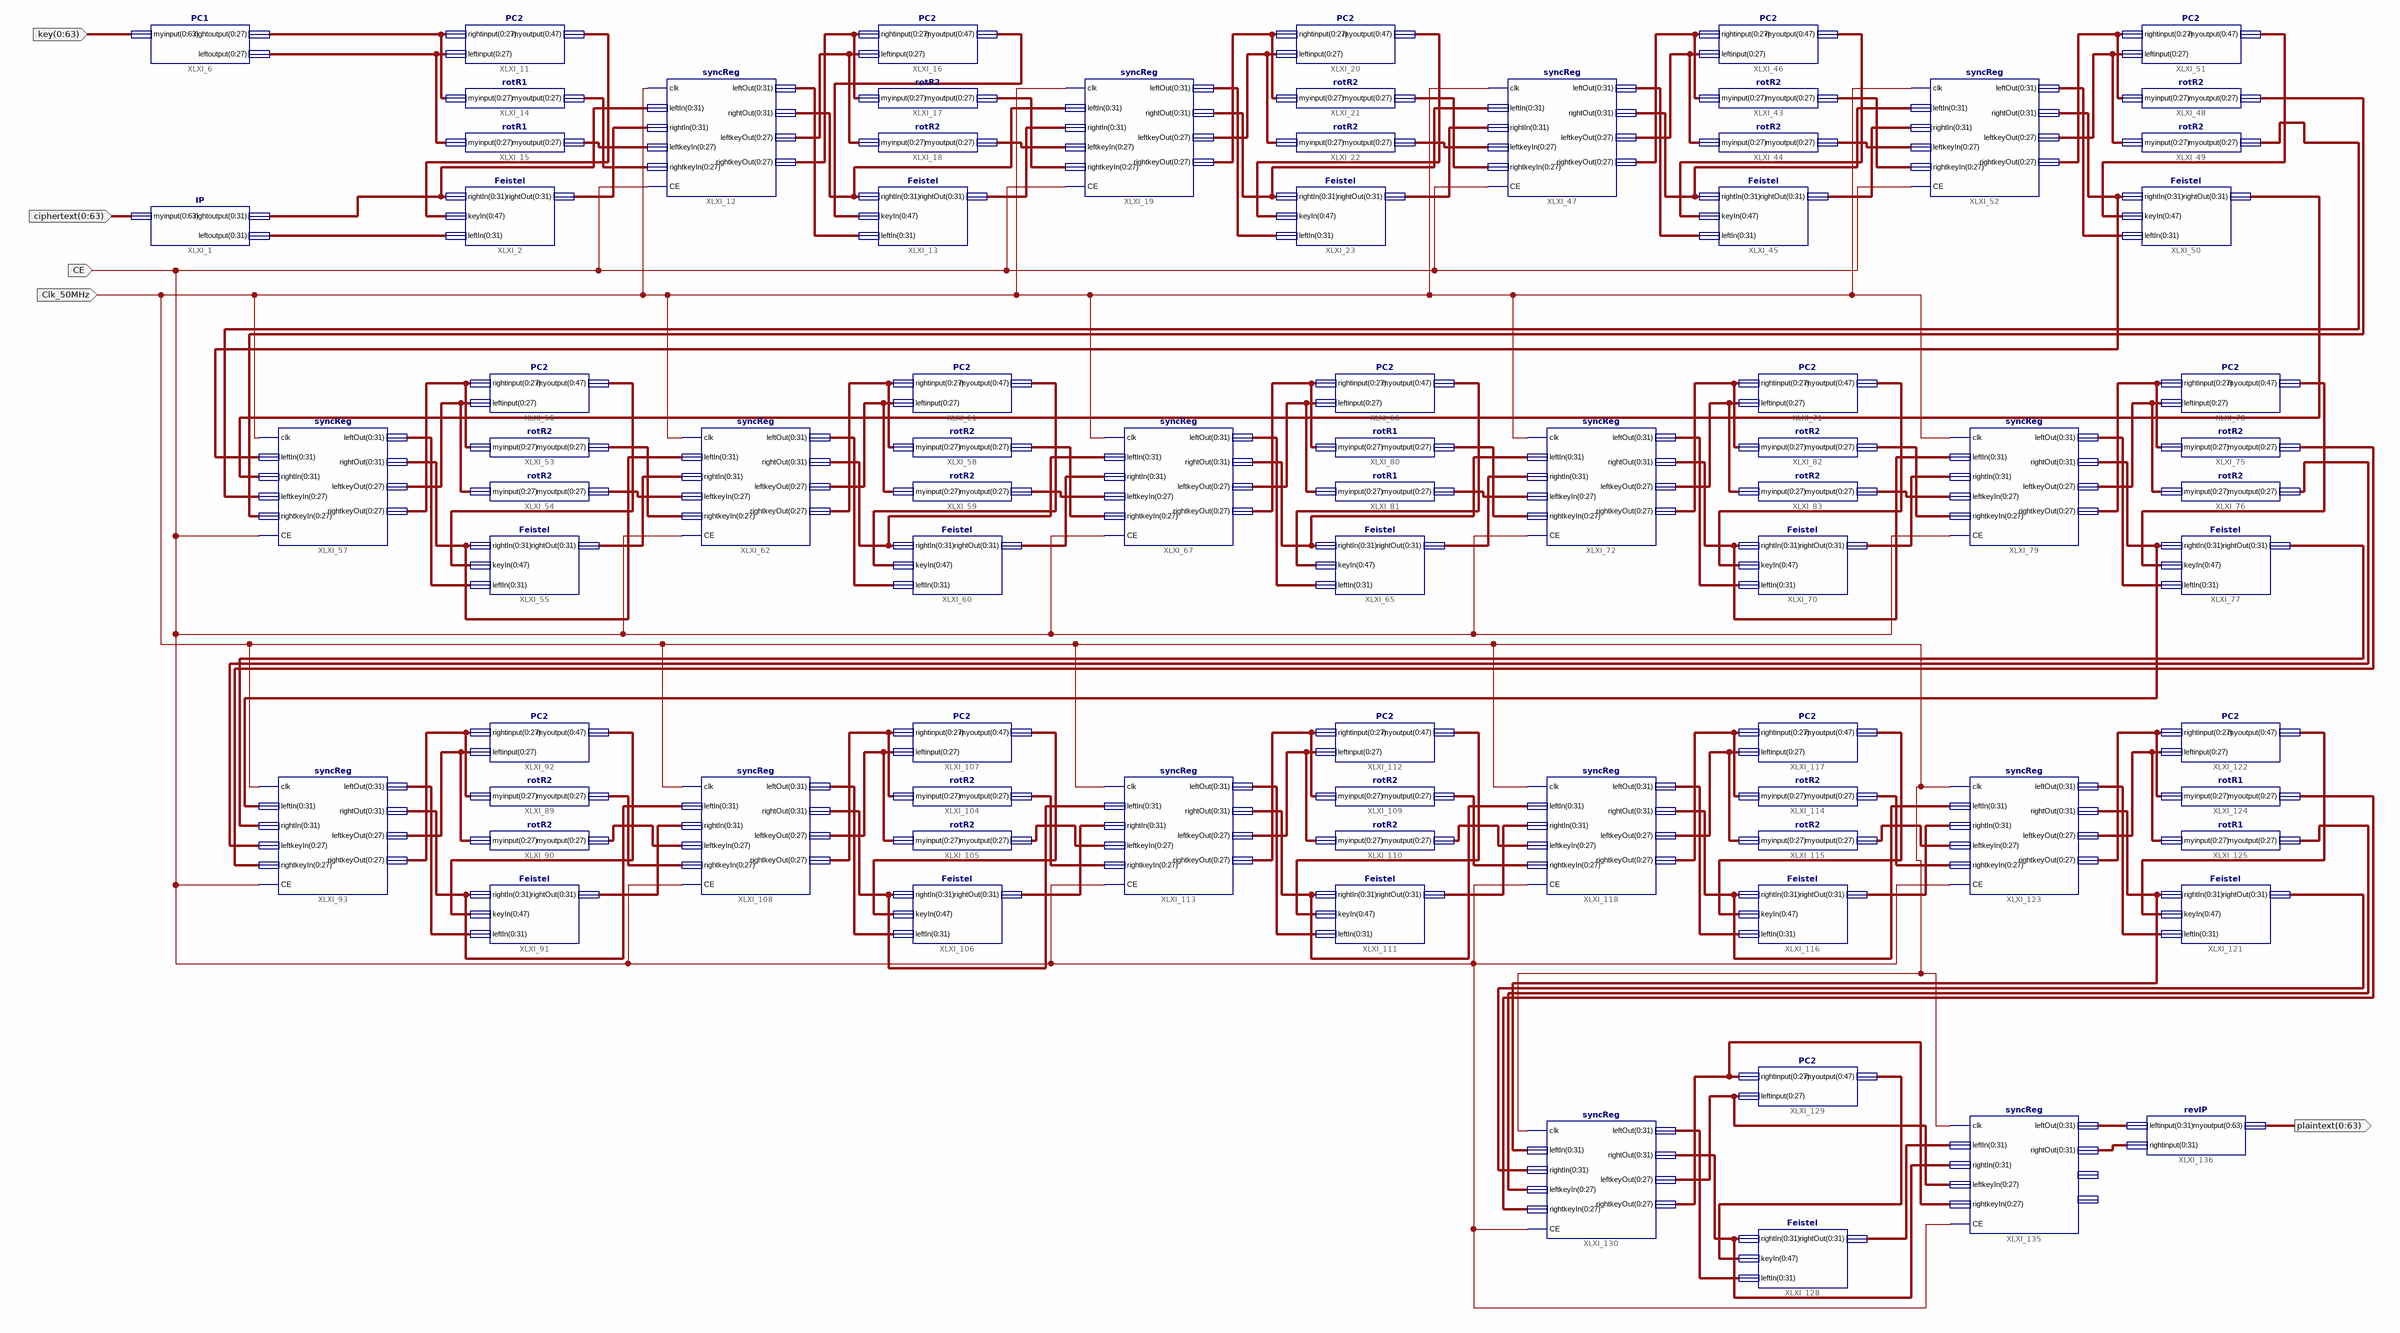
[diagram p0: schematic sheet 1]
// Xilinx ISE schematic DES_Decoder.sch (spartan3e) as structural Verilog: 81 symbols, 5 ports
module DES_Decoder (
  input  [0:63] ciphertext,
  input  [0:63] key,
  input  CE,
  input  Clk_50MHz,
  output [0:63] plaintext
);

  wire [27:0] XLXN_112, XLXN_113, XLXN_116, XLXN_117, XLXN_120, XLXN_121, XLXN_130, XLXN_131, XLXN_134,
       XLXN_135, XLXN_171, XLXN_172, XLXN_176, XLXN_177, XLXN_180, XLXN_181, XLXN_185, XLXN_186, XLXN_189,
       XLXN_190, XLXN_198, XLXN_199, XLXN_203, XLXN_204, XLXN_207, XLXN_208, XLXN_212, XLXN_213, XLXN_216,
       XLXN_217, XLXN_221, XLXN_222, XLXN_225, XLXN_226, XLXN_230, XLXN_231, XLXN_246, XLXN_247, XLXN_271,
       XLXN_272, XLXN_280, XLXN_284, XLXN_288, XLXN_289, XLXN_292, XLXN_293, XLXN_297, XLXN_298, XLXN_301,
       XLXN_302, XLXN_306, XLXN_307, XLXN_310, XLXN_311, XLXN_322, XLXN_323, XLXN_326, XLXN_330, XLXN_334,
       XLXN_337, XLXN_350, XLXN_352;
  wire [31:0] XLXN_20, XLXN_108, XLXN_118, XLXN_122, XLXN_123, XLXN_129, XLXN_132, XLXN_133, XLXN_169,
       XLXN_170, XLXN_175, XLXN_178, XLXN_179, XLXN_184, XLXN_187, XLXN_188, XLXN_196, XLXN_197, XLXN_202,
       XLXN_205, XLXN_206, XLXN_211, XLXN_214, XLXN_215, XLXN_220, XLXN_223, XLXN_224, XLXN_229, XLXN_244,
       XLXN_245, XLXN_269, XLXN_270, XLXN_285, XLXN_286, XLXN_287, XLXN_294, XLXN_295, XLXN_296, XLXN_303,
       XLXN_305, XLXN_312, XLXN_314, XLXN_332, XLXN_342, XLXN_359, XLXN_363, XLXN_387, XLXN_389, XLXN_390,
       XLXN_391;
  wire [47:0] XLXN_107, XLXN_125, XLXN_138, XLXN_173, XLXN_182, XLXN_191, XLXN_200, XLXN_209, XLXN_218,
       XLXN_227, XLXN_248, XLXN_273, XLXN_290, XLXN_299, XLXN_308, XLXN_317;

  IP XLXI_1 (
    .myinput(ciphertext),
    .rightoutput({XLXN_118[0], XLXN_118[1], XLXN_118[2], XLXN_118[3], XLXN_118[4], XLXN_118[5], XLXN_118[6], XLXN_118[7], XLXN_118[8], XLXN_118[9], XLXN_118[10], XLXN_118[11], XLXN_118[12], XLXN_118[13], XLXN_118[14], XLXN_118[15], XLXN_118[16], XLXN_118[17], XLXN_118[18], XLXN_118[19], XLXN_118[20], XLXN_118[21], XLXN_118[22], XLXN_118[23], XLXN_118[24], XLXN_118[25], XLXN_118[26], XLXN_118[27], XLXN_118[28], XLXN_118[29], XLXN_118[30], XLXN_118[31]}),
    .leftoutput({XLXN_20[0], XLXN_20[1], XLXN_20[2], XLXN_20[3], XLXN_20[4], XLXN_20[5], XLXN_20[6], XLXN_20[7], XLXN_20[8], XLXN_20[9], XLXN_20[10], XLXN_20[11], XLXN_20[12], XLXN_20[13], XLXN_20[14], XLXN_20[15], XLXN_20[16], XLXN_20[17], XLXN_20[18], XLXN_20[19], XLXN_20[20], XLXN_20[21], XLXN_20[22], XLXN_20[23], XLXN_20[24], XLXN_20[25], XLXN_20[26], XLXN_20[27], XLXN_20[28], XLXN_20[29], XLXN_20[30], XLXN_20[31]}));
  Feistel XLXI_2 (
    .rightIn({XLXN_118[0], XLXN_118[1], XLXN_118[2], XLXN_118[3], XLXN_118[4], XLXN_118[5], XLXN_118[6], XLXN_118[7], XLXN_118[8], XLXN_118[9], XLXN_118[10], XLXN_118[11], XLXN_118[12], XLXN_118[13], XLXN_118[14], XLXN_118[15], XLXN_118[16], XLXN_118[17], XLXN_118[18], XLXN_118[19], XLXN_118[20], XLXN_118[21], XLXN_118[22], XLXN_118[23], XLXN_118[24], XLXN_118[25], XLXN_118[26], XLXN_118[27], XLXN_118[28], XLXN_118[29], XLXN_118[30], XLXN_118[31]}),
    .keyIn({XLXN_107[0], XLXN_107[1], XLXN_107[2], XLXN_107[3], XLXN_107[4], XLXN_107[5], XLXN_107[6], XLXN_107[7], XLXN_107[8], XLXN_107[9], XLXN_107[10], XLXN_107[11], XLXN_107[12], XLXN_107[13], XLXN_107[14], XLXN_107[15], XLXN_107[16], XLXN_107[17], XLXN_107[18], XLXN_107[19], XLXN_107[20], XLXN_107[21], XLXN_107[22], XLXN_107[23], XLXN_107[24], XLXN_107[25], XLXN_107[26], XLXN_107[27], XLXN_107[28], XLXN_107[29], XLXN_107[30], XLXN_107[31], XLXN_107[32], XLXN_107[33], XLXN_107[34], XLXN_107[35], XLXN_107[36], XLXN_107[37], XLXN_107[38], XLXN_107[39], XLXN_107[40], XLXN_107[41], XLXN_107[42], XLXN_107[43], XLXN_107[44], XLXN_107[45], XLXN_107[46], XLXN_107[47]}),
    .leftIn({XLXN_20[0], XLXN_20[1], XLXN_20[2], XLXN_20[3], XLXN_20[4], XLXN_20[5], XLXN_20[6], XLXN_20[7], XLXN_20[8], XLXN_20[9], XLXN_20[10], XLXN_20[11], XLXN_20[12], XLXN_20[13], XLXN_20[14], XLXN_20[15], XLXN_20[16], XLXN_20[17], XLXN_20[18], XLXN_20[19], XLXN_20[20], XLXN_20[21], XLXN_20[22], XLXN_20[23], XLXN_20[24], XLXN_20[25], XLXN_20[26], XLXN_20[27], XLXN_20[28], XLXN_20[29], XLXN_20[30], XLXN_20[31]}),
    .rightOut({XLXN_108[0], XLXN_108[1], XLXN_108[2], XLXN_108[3], XLXN_108[4], XLXN_108[5], XLXN_108[6], XLXN_108[7], XLXN_108[8], XLXN_108[9], XLXN_108[10], XLXN_108[11], XLXN_108[12], XLXN_108[13], XLXN_108[14], XLXN_108[15], XLXN_108[16], XLXN_108[17], XLXN_108[18], XLXN_108[19], XLXN_108[20], XLXN_108[21], XLXN_108[22], XLXN_108[23], XLXN_108[24], XLXN_108[25], XLXN_108[26], XLXN_108[27], XLXN_108[28], XLXN_108[29], XLXN_108[30], XLXN_108[31]}));
  PC1 XLXI_6 (
    .myinput(key),
    .rightoutput({XLXN_112[0], XLXN_112[1], XLXN_112[2], XLXN_112[3], XLXN_112[4], XLXN_112[5], XLXN_112[6], XLXN_112[7], XLXN_112[8], XLXN_112[9], XLXN_112[10], XLXN_112[11], XLXN_112[12], XLXN_112[13], XLXN_112[14], XLXN_112[15], XLXN_112[16], XLXN_112[17], XLXN_112[18], XLXN_112[19], XLXN_112[20], XLXN_112[21], XLXN_112[22], XLXN_112[23], XLXN_112[24], XLXN_112[25], XLXN_112[26], XLXN_112[27]}),
    .leftoutput({XLXN_113[0], XLXN_113[1], XLXN_113[2], XLXN_113[3], XLXN_113[4], XLXN_113[5], XLXN_113[6], XLXN_113[7], XLXN_113[8], XLXN_113[9], XLXN_113[10], XLXN_113[11], XLXN_113[12], XLXN_113[13], XLXN_113[14], XLXN_113[15], XLXN_113[16], XLXN_113[17], XLXN_113[18], XLXN_113[19], XLXN_113[20], XLXN_113[21], XLXN_113[22], XLXN_113[23], XLXN_113[24], XLXN_113[25], XLXN_113[26], XLXN_113[27]}));
  PC2 XLXI_11 (
    .rightinput({XLXN_112[0], XLXN_112[1], XLXN_112[2], XLXN_112[3], XLXN_112[4], XLXN_112[5], XLXN_112[6], XLXN_112[7], XLXN_112[8], XLXN_112[9], XLXN_112[10], XLXN_112[11], XLXN_112[12], XLXN_112[13], XLXN_112[14], XLXN_112[15], XLXN_112[16], XLXN_112[17], XLXN_112[18], XLXN_112[19], XLXN_112[20], XLXN_112[21], XLXN_112[22], XLXN_112[23], XLXN_112[24], XLXN_112[25], XLXN_112[26], XLXN_112[27]}),
    .leftinput({XLXN_113[0], XLXN_113[1], XLXN_113[2], XLXN_113[3], XLXN_113[4], XLXN_113[5], XLXN_113[6], XLXN_113[7], XLXN_113[8], XLXN_113[9], XLXN_113[10], XLXN_113[11], XLXN_113[12], XLXN_113[13], XLXN_113[14], XLXN_113[15], XLXN_113[16], XLXN_113[17], XLXN_113[18], XLXN_113[19], XLXN_113[20], XLXN_113[21], XLXN_113[22], XLXN_113[23], XLXN_113[24], XLXN_113[25], XLXN_113[26], XLXN_113[27]}),
    .myoutput({XLXN_107[0], XLXN_107[1], XLXN_107[2], XLXN_107[3], XLXN_107[4], XLXN_107[5], XLXN_107[6], XLXN_107[7], XLXN_107[8], XLXN_107[9], XLXN_107[10], XLXN_107[11], XLXN_107[12], XLXN_107[13], XLXN_107[14], XLXN_107[15], XLXN_107[16], XLXN_107[17], XLXN_107[18], XLXN_107[19], XLXN_107[20], XLXN_107[21], XLXN_107[22], XLXN_107[23], XLXN_107[24], XLXN_107[25], XLXN_107[26], XLXN_107[27], XLXN_107[28], XLXN_107[29], XLXN_107[30], XLXN_107[31], XLXN_107[32], XLXN_107[33], XLXN_107[34], XLXN_107[35], XLXN_107[36], XLXN_107[37], XLXN_107[38], XLXN_107[39], XLXN_107[40], XLXN_107[41], XLXN_107[42], XLXN_107[43], XLXN_107[44], XLXN_107[45], XLXN_107[46], XLXN_107[47]}));
  syncReg XLXI_12 (
    .clk(Clk_50MHz),
    .leftIn({XLXN_118[0], XLXN_118[1], XLXN_118[2], XLXN_118[3], XLXN_118[4], XLXN_118[5], XLXN_118[6], XLXN_118[7], XLXN_118[8], XLXN_118[9], XLXN_118[10], XLXN_118[11], XLXN_118[12], XLXN_118[13], XLXN_118[14], XLXN_118[15], XLXN_118[16], XLXN_118[17], XLXN_118[18], XLXN_118[19], XLXN_118[20], XLXN_118[21], XLXN_118[22], XLXN_118[23], XLXN_118[24], XLXN_118[25], XLXN_118[26], XLXN_118[27], XLXN_118[28], XLXN_118[29], XLXN_118[30], XLXN_118[31]}),
    .rightIn({XLXN_108[0], XLXN_108[1], XLXN_108[2], XLXN_108[3], XLXN_108[4], XLXN_108[5], XLXN_108[6], XLXN_108[7], XLXN_108[8], XLXN_108[9], XLXN_108[10], XLXN_108[11], XLXN_108[12], XLXN_108[13], XLXN_108[14], XLXN_108[15], XLXN_108[16], XLXN_108[17], XLXN_108[18], XLXN_108[19], XLXN_108[20], XLXN_108[21], XLXN_108[22], XLXN_108[23], XLXN_108[24], XLXN_108[25], XLXN_108[26], XLXN_108[27], XLXN_108[28], XLXN_108[29], XLXN_108[30], XLXN_108[31]}),
    .leftkeyIn({XLXN_117[0], XLXN_117[1], XLXN_117[2], XLXN_117[3], XLXN_117[4], XLXN_117[5], XLXN_117[6], XLXN_117[7], XLXN_117[8], XLXN_117[9], XLXN_117[10], XLXN_117[11], XLXN_117[12], XLXN_117[13], XLXN_117[14], XLXN_117[15], XLXN_117[16], XLXN_117[17], XLXN_117[18], XLXN_117[19], XLXN_117[20], XLXN_117[21], XLXN_117[22], XLXN_117[23], XLXN_117[24], XLXN_117[25], XLXN_117[26], XLXN_117[27]}),
    .rightkeyIn({XLXN_116[0], XLXN_116[1], XLXN_116[2], XLXN_116[3], XLXN_116[4], XLXN_116[5], XLXN_116[6], XLXN_116[7], XLXN_116[8], XLXN_116[9], XLXN_116[10], XLXN_116[11], XLXN_116[12], XLXN_116[13], XLXN_116[14], XLXN_116[15], XLXN_116[16], XLXN_116[17], XLXN_116[18], XLXN_116[19], XLXN_116[20], XLXN_116[21], XLXN_116[22], XLXN_116[23], XLXN_116[24], XLXN_116[25], XLXN_116[26], XLXN_116[27]}),
    .leftOut({XLXN_123[0], XLXN_123[1], XLXN_123[2], XLXN_123[3], XLXN_123[4], XLXN_123[5], XLXN_123[6], XLXN_123[7], XLXN_123[8], XLXN_123[9], XLXN_123[10], XLXN_123[11], XLXN_123[12], XLXN_123[13], XLXN_123[14], XLXN_123[15], XLXN_123[16], XLXN_123[17], XLXN_123[18], XLXN_123[19], XLXN_123[20], XLXN_123[21], XLXN_123[22], XLXN_123[23], XLXN_123[24], XLXN_123[25], XLXN_123[26], XLXN_123[27], XLXN_123[28], XLXN_123[29], XLXN_123[30], XLXN_123[31]}),
    .rightOut({XLXN_122[0], XLXN_122[1], XLXN_122[2], XLXN_122[3], XLXN_122[4], XLXN_122[5], XLXN_122[6], XLXN_122[7], XLXN_122[8], XLXN_122[9], XLXN_122[10], XLXN_122[11], XLXN_122[12], XLXN_122[13], XLXN_122[14], XLXN_122[15], XLXN_122[16], XLXN_122[17], XLXN_122[18], XLXN_122[19], XLXN_122[20], XLXN_122[21], XLXN_122[22], XLXN_122[23], XLXN_122[24], XLXN_122[25], XLXN_122[26], XLXN_122[27], XLXN_122[28], XLXN_122[29], XLXN_122[30], XLXN_122[31]}),
    .leftkeyOut({XLXN_121[0], XLXN_121[1], XLXN_121[2], XLXN_121[3], XLXN_121[4], XLXN_121[5], XLXN_121[6], XLXN_121[7], XLXN_121[8], XLXN_121[9], XLXN_121[10], XLXN_121[11], XLXN_121[12], XLXN_121[13], XLXN_121[14], XLXN_121[15], XLXN_121[16], XLXN_121[17], XLXN_121[18], XLXN_121[19], XLXN_121[20], XLXN_121[21], XLXN_121[22], XLXN_121[23], XLXN_121[24], XLXN_121[25], XLXN_121[26], XLXN_121[27]}),
    .rightkeyOut({XLXN_120[0], XLXN_120[1], XLXN_120[2], XLXN_120[3], XLXN_120[4], XLXN_120[5], XLXN_120[6], XLXN_120[7], XLXN_120[8], XLXN_120[9], XLXN_120[10], XLXN_120[11], XLXN_120[12], XLXN_120[13], XLXN_120[14], XLXN_120[15], XLXN_120[16], XLXN_120[17], XLXN_120[18], XLXN_120[19], XLXN_120[20], XLXN_120[21], XLXN_120[22], XLXN_120[23], XLXN_120[24], XLXN_120[25], XLXN_120[26], XLXN_120[27]}),
    .CE(CE));
  Feistel XLXI_13 (
    .rightIn({XLXN_122[0], XLXN_122[1], XLXN_122[2], XLXN_122[3], XLXN_122[4], XLXN_122[5], XLXN_122[6], XLXN_122[7], XLXN_122[8], XLXN_122[9], XLXN_122[10], XLXN_122[11], XLXN_122[12], XLXN_122[13], XLXN_122[14], XLXN_122[15], XLXN_122[16], XLXN_122[17], XLXN_122[18], XLXN_122[19], XLXN_122[20], XLXN_122[21], XLXN_122[22], XLXN_122[23], XLXN_122[24], XLXN_122[25], XLXN_122[26], XLXN_122[27], XLXN_122[28], XLXN_122[29], XLXN_122[30], XLXN_122[31]}),
    .keyIn({XLXN_125[0], XLXN_125[1], XLXN_125[2], XLXN_125[3], XLXN_125[4], XLXN_125[5], XLXN_125[6], XLXN_125[7], XLXN_125[8], XLXN_125[9], XLXN_125[10], XLXN_125[11], XLXN_125[12], XLXN_125[13], XLXN_125[14], XLXN_125[15], XLXN_125[16], XLXN_125[17], XLXN_125[18], XLXN_125[19], XLXN_125[20], XLXN_125[21], XLXN_125[22], XLXN_125[23], XLXN_125[24], XLXN_125[25], XLXN_125[26], XLXN_125[27], XLXN_125[28], XLXN_125[29], XLXN_125[30], XLXN_125[31], XLXN_125[32], XLXN_125[33], XLXN_125[34], XLXN_125[35], XLXN_125[36], XLXN_125[37], XLXN_125[38], XLXN_125[39], XLXN_125[40], XLXN_125[41], XLXN_125[42], XLXN_125[43], XLXN_125[44], XLXN_125[45], XLXN_125[46], XLXN_125[47]}),
    .leftIn({XLXN_123[0], XLXN_123[1], XLXN_123[2], XLXN_123[3], XLXN_123[4], XLXN_123[5], XLXN_123[6], XLXN_123[7], XLXN_123[8], XLXN_123[9], XLXN_123[10], XLXN_123[11], XLXN_123[12], XLXN_123[13], XLXN_123[14], XLXN_123[15], XLXN_123[16], XLXN_123[17], XLXN_123[18], XLXN_123[19], XLXN_123[20], XLXN_123[21], XLXN_123[22], XLXN_123[23], XLXN_123[24], XLXN_123[25], XLXN_123[26], XLXN_123[27], XLXN_123[28], XLXN_123[29], XLXN_123[30], XLXN_123[31]}),
    .rightOut({XLXN_129[0], XLXN_129[1], XLXN_129[2], XLXN_129[3], XLXN_129[4], XLXN_129[5], XLXN_129[6], XLXN_129[7], XLXN_129[8], XLXN_129[9], XLXN_129[10], XLXN_129[11], XLXN_129[12], XLXN_129[13], XLXN_129[14], XLXN_129[15], XLXN_129[16], XLXN_129[17], XLXN_129[18], XLXN_129[19], XLXN_129[20], XLXN_129[21], XLXN_129[22], XLXN_129[23], XLXN_129[24], XLXN_129[25], XLXN_129[26], XLXN_129[27], XLXN_129[28], XLXN_129[29], XLXN_129[30], XLXN_129[31]}));
  rotR1 XLXI_14 (
    .myinput({XLXN_112[0], XLXN_112[1], XLXN_112[2], XLXN_112[3], XLXN_112[4], XLXN_112[5], XLXN_112[6], XLXN_112[7], XLXN_112[8], XLXN_112[9], XLXN_112[10], XLXN_112[11], XLXN_112[12], XLXN_112[13], XLXN_112[14], XLXN_112[15], XLXN_112[16], XLXN_112[17], XLXN_112[18], XLXN_112[19], XLXN_112[20], XLXN_112[21], XLXN_112[22], XLXN_112[23], XLXN_112[24], XLXN_112[25], XLXN_112[26], XLXN_112[27]}),
    .myoutput({XLXN_116[0], XLXN_116[1], XLXN_116[2], XLXN_116[3], XLXN_116[4], XLXN_116[5], XLXN_116[6], XLXN_116[7], XLXN_116[8], XLXN_116[9], XLXN_116[10], XLXN_116[11], XLXN_116[12], XLXN_116[13], XLXN_116[14], XLXN_116[15], XLXN_116[16], XLXN_116[17], XLXN_116[18], XLXN_116[19], XLXN_116[20], XLXN_116[21], XLXN_116[22], XLXN_116[23], XLXN_116[24], XLXN_116[25], XLXN_116[26], XLXN_116[27]}));
  rotR1 XLXI_15 (
    .myinput({XLXN_113[0], XLXN_113[1], XLXN_113[2], XLXN_113[3], XLXN_113[4], XLXN_113[5], XLXN_113[6], XLXN_113[7], XLXN_113[8], XLXN_113[9], XLXN_113[10], XLXN_113[11], XLXN_113[12], XLXN_113[13], XLXN_113[14], XLXN_113[15], XLXN_113[16], XLXN_113[17], XLXN_113[18], XLXN_113[19], XLXN_113[20], XLXN_113[21], XLXN_113[22], XLXN_113[23], XLXN_113[24], XLXN_113[25], XLXN_113[26], XLXN_113[27]}),
    .myoutput({XLXN_117[0], XLXN_117[1], XLXN_117[2], XLXN_117[3], XLXN_117[4], XLXN_117[5], XLXN_117[6], XLXN_117[7], XLXN_117[8], XLXN_117[9], XLXN_117[10], XLXN_117[11], XLXN_117[12], XLXN_117[13], XLXN_117[14], XLXN_117[15], XLXN_117[16], XLXN_117[17], XLXN_117[18], XLXN_117[19], XLXN_117[20], XLXN_117[21], XLXN_117[22], XLXN_117[23], XLXN_117[24], XLXN_117[25], XLXN_117[26], XLXN_117[27]}));
  PC2 XLXI_16 (
    .rightinput({XLXN_120[0], XLXN_120[1], XLXN_120[2], XLXN_120[3], XLXN_120[4], XLXN_120[5], XLXN_120[6], XLXN_120[7], XLXN_120[8], XLXN_120[9], XLXN_120[10], XLXN_120[11], XLXN_120[12], XLXN_120[13], XLXN_120[14], XLXN_120[15], XLXN_120[16], XLXN_120[17], XLXN_120[18], XLXN_120[19], XLXN_120[20], XLXN_120[21], XLXN_120[22], XLXN_120[23], XLXN_120[24], XLXN_120[25], XLXN_120[26], XLXN_120[27]}),
    .leftinput({XLXN_121[0], XLXN_121[1], XLXN_121[2], XLXN_121[3], XLXN_121[4], XLXN_121[5], XLXN_121[6], XLXN_121[7], XLXN_121[8], XLXN_121[9], XLXN_121[10], XLXN_121[11], XLXN_121[12], XLXN_121[13], XLXN_121[14], XLXN_121[15], XLXN_121[16], XLXN_121[17], XLXN_121[18], XLXN_121[19], XLXN_121[20], XLXN_121[21], XLXN_121[22], XLXN_121[23], XLXN_121[24], XLXN_121[25], XLXN_121[26], XLXN_121[27]}),
    .myoutput({XLXN_125[0], XLXN_125[1], XLXN_125[2], XLXN_125[3], XLXN_125[4], XLXN_125[5], XLXN_125[6], XLXN_125[7], XLXN_125[8], XLXN_125[9], XLXN_125[10], XLXN_125[11], XLXN_125[12], XLXN_125[13], XLXN_125[14], XLXN_125[15], XLXN_125[16], XLXN_125[17], XLXN_125[18], XLXN_125[19], XLXN_125[20], XLXN_125[21], XLXN_125[22], XLXN_125[23], XLXN_125[24], XLXN_125[25], XLXN_125[26], XLXN_125[27], XLXN_125[28], XLXN_125[29], XLXN_125[30], XLXN_125[31], XLXN_125[32], XLXN_125[33], XLXN_125[34], XLXN_125[35], XLXN_125[36], XLXN_125[37], XLXN_125[38], XLXN_125[39], XLXN_125[40], XLXN_125[41], XLXN_125[42], XLXN_125[43], XLXN_125[44], XLXN_125[45], XLXN_125[46], XLXN_125[47]}));
  rotR2 XLXI_17 (
    .myinput({XLXN_120[0], XLXN_120[1], XLXN_120[2], XLXN_120[3], XLXN_120[4], XLXN_120[5], XLXN_120[6], XLXN_120[7], XLXN_120[8], XLXN_120[9], XLXN_120[10], XLXN_120[11], XLXN_120[12], XLXN_120[13], XLXN_120[14], XLXN_120[15], XLXN_120[16], XLXN_120[17], XLXN_120[18], XLXN_120[19], XLXN_120[20], XLXN_120[21], XLXN_120[22], XLXN_120[23], XLXN_120[24], XLXN_120[25], XLXN_120[26], XLXN_120[27]}),
    .myoutput({XLXN_130[0], XLXN_130[1], XLXN_130[2], XLXN_130[3], XLXN_130[4], XLXN_130[5], XLXN_130[6], XLXN_130[7], XLXN_130[8], XLXN_130[9], XLXN_130[10], XLXN_130[11], XLXN_130[12], XLXN_130[13], XLXN_130[14], XLXN_130[15], XLXN_130[16], XLXN_130[17], XLXN_130[18], XLXN_130[19], XLXN_130[20], XLXN_130[21], XLXN_130[22], XLXN_130[23], XLXN_130[24], XLXN_130[25], XLXN_130[26], XLXN_130[27]}));
  rotR2 XLXI_18 (
    .myinput({XLXN_121[0], XLXN_121[1], XLXN_121[2], XLXN_121[3], XLXN_121[4], XLXN_121[5], XLXN_121[6], XLXN_121[7], XLXN_121[8], XLXN_121[9], XLXN_121[10], XLXN_121[11], XLXN_121[12], XLXN_121[13], XLXN_121[14], XLXN_121[15], XLXN_121[16], XLXN_121[17], XLXN_121[18], XLXN_121[19], XLXN_121[20], XLXN_121[21], XLXN_121[22], XLXN_121[23], XLXN_121[24], XLXN_121[25], XLXN_121[26], XLXN_121[27]}),
    .myoutput({XLXN_131[0], XLXN_131[1], XLXN_131[2], XLXN_131[3], XLXN_131[4], XLXN_131[5], XLXN_131[6], XLXN_131[7], XLXN_131[8], XLXN_131[9], XLXN_131[10], XLXN_131[11], XLXN_131[12], XLXN_131[13], XLXN_131[14], XLXN_131[15], XLXN_131[16], XLXN_131[17], XLXN_131[18], XLXN_131[19], XLXN_131[20], XLXN_131[21], XLXN_131[22], XLXN_131[23], XLXN_131[24], XLXN_131[25], XLXN_131[26], XLXN_131[27]}));
  syncReg XLXI_19 (
    .clk(Clk_50MHz),
    .leftIn({XLXN_122[0], XLXN_122[1], XLXN_122[2], XLXN_122[3], XLXN_122[4], XLXN_122[5], XLXN_122[6], XLXN_122[7], XLXN_122[8], XLXN_122[9], XLXN_122[10], XLXN_122[11], XLXN_122[12], XLXN_122[13], XLXN_122[14], XLXN_122[15], XLXN_122[16], XLXN_122[17], XLXN_122[18], XLXN_122[19], XLXN_122[20], XLXN_122[21], XLXN_122[22], XLXN_122[23], XLXN_122[24], XLXN_122[25], XLXN_122[26], XLXN_122[27], XLXN_122[28], XLXN_122[29], XLXN_122[30], XLXN_122[31]}),
    .rightIn({XLXN_129[0], XLXN_129[1], XLXN_129[2], XLXN_129[3], XLXN_129[4], XLXN_129[5], XLXN_129[6], XLXN_129[7], XLXN_129[8], XLXN_129[9], XLXN_129[10], XLXN_129[11], XLXN_129[12], XLXN_129[13], XLXN_129[14], XLXN_129[15], XLXN_129[16], XLXN_129[17], XLXN_129[18], XLXN_129[19], XLXN_129[20], XLXN_129[21], XLXN_129[22], XLXN_129[23], XLXN_129[24], XLXN_129[25], XLXN_129[26], XLXN_129[27], XLXN_129[28], XLXN_129[29], XLXN_129[30], XLXN_129[31]}),
    .leftkeyIn({XLXN_131[0], XLXN_131[1], XLXN_131[2], XLXN_131[3], XLXN_131[4], XLXN_131[5], XLXN_131[6], XLXN_131[7], XLXN_131[8], XLXN_131[9], XLXN_131[10], XLXN_131[11], XLXN_131[12], XLXN_131[13], XLXN_131[14], XLXN_131[15], XLXN_131[16], XLXN_131[17], XLXN_131[18], XLXN_131[19], XLXN_131[20], XLXN_131[21], XLXN_131[22], XLXN_131[23], XLXN_131[24], XLXN_131[25], XLXN_131[26], XLXN_131[27]}),
    .rightkeyIn({XLXN_130[0], XLXN_130[1], XLXN_130[2], XLXN_130[3], XLXN_130[4], XLXN_130[5], XLXN_130[6], XLXN_130[7], XLXN_130[8], XLXN_130[9], XLXN_130[10], XLXN_130[11], XLXN_130[12], XLXN_130[13], XLXN_130[14], XLXN_130[15], XLXN_130[16], XLXN_130[17], XLXN_130[18], XLXN_130[19], XLXN_130[20], XLXN_130[21], XLXN_130[22], XLXN_130[23], XLXN_130[24], XLXN_130[25], XLXN_130[26], XLXN_130[27]}),
    .leftOut({XLXN_133[0], XLXN_133[1], XLXN_133[2], XLXN_133[3], XLXN_133[4], XLXN_133[5], XLXN_133[6], XLXN_133[7], XLXN_133[8], XLXN_133[9], XLXN_133[10], XLXN_133[11], XLXN_133[12], XLXN_133[13], XLXN_133[14], XLXN_133[15], XLXN_133[16], XLXN_133[17], XLXN_133[18], XLXN_133[19], XLXN_133[20], XLXN_133[21], XLXN_133[22], XLXN_133[23], XLXN_133[24], XLXN_133[25], XLXN_133[26], XLXN_133[27], XLXN_133[28], XLXN_133[29], XLXN_133[30], XLXN_133[31]}),
    .rightOut({XLXN_132[0], XLXN_132[1], XLXN_132[2], XLXN_132[3], XLXN_132[4], XLXN_132[5], XLXN_132[6], XLXN_132[7], XLXN_132[8], XLXN_132[9], XLXN_132[10], XLXN_132[11], XLXN_132[12], XLXN_132[13], XLXN_132[14], XLXN_132[15], XLXN_132[16], XLXN_132[17], XLXN_132[18], XLXN_132[19], XLXN_132[20], XLXN_132[21], XLXN_132[22], XLXN_132[23], XLXN_132[24], XLXN_132[25], XLXN_132[26], XLXN_132[27], XLXN_132[28], XLXN_132[29], XLXN_132[30], XLXN_132[31]}),
    .leftkeyOut({XLXN_134[0], XLXN_134[1], XLXN_134[2], XLXN_134[3], XLXN_134[4], XLXN_134[5], XLXN_134[6], XLXN_134[7], XLXN_134[8], XLXN_134[9], XLXN_134[10], XLXN_134[11], XLXN_134[12], XLXN_134[13], XLXN_134[14], XLXN_134[15], XLXN_134[16], XLXN_134[17], XLXN_134[18], XLXN_134[19], XLXN_134[20], XLXN_134[21], XLXN_134[22], XLXN_134[23], XLXN_134[24], XLXN_134[25], XLXN_134[26], XLXN_134[27]}),
    .rightkeyOut({XLXN_135[0], XLXN_135[1], XLXN_135[2], XLXN_135[3], XLXN_135[4], XLXN_135[5], XLXN_135[6], XLXN_135[7], XLXN_135[8], XLXN_135[9], XLXN_135[10], XLXN_135[11], XLXN_135[12], XLXN_135[13], XLXN_135[14], XLXN_135[15], XLXN_135[16], XLXN_135[17], XLXN_135[18], XLXN_135[19], XLXN_135[20], XLXN_135[21], XLXN_135[22], XLXN_135[23], XLXN_135[24], XLXN_135[25], XLXN_135[26], XLXN_135[27]}),
    .CE(CE));
  PC2 XLXI_20 (
    .rightinput({XLXN_135[0], XLXN_135[1], XLXN_135[2], XLXN_135[3], XLXN_135[4], XLXN_135[5], XLXN_135[6], XLXN_135[7], XLXN_135[8], XLXN_135[9], XLXN_135[10], XLXN_135[11], XLXN_135[12], XLXN_135[13], XLXN_135[14], XLXN_135[15], XLXN_135[16], XLXN_135[17], XLXN_135[18], XLXN_135[19], XLXN_135[20], XLXN_135[21], XLXN_135[22], XLXN_135[23], XLXN_135[24], XLXN_135[25], XLXN_135[26], XLXN_135[27]}),
    .leftinput({XLXN_134[0], XLXN_134[1], XLXN_134[2], XLXN_134[3], XLXN_134[4], XLXN_134[5], XLXN_134[6], XLXN_134[7], XLXN_134[8], XLXN_134[9], XLXN_134[10], XLXN_134[11], XLXN_134[12], XLXN_134[13], XLXN_134[14], XLXN_134[15], XLXN_134[16], XLXN_134[17], XLXN_134[18], XLXN_134[19], XLXN_134[20], XLXN_134[21], XLXN_134[22], XLXN_134[23], XLXN_134[24], XLXN_134[25], XLXN_134[26], XLXN_134[27]}),
    .myoutput({XLXN_138[0], XLXN_138[1], XLXN_138[2], XLXN_138[3], XLXN_138[4], XLXN_138[5], XLXN_138[6], XLXN_138[7], XLXN_138[8], XLXN_138[9], XLXN_138[10], XLXN_138[11], XLXN_138[12], XLXN_138[13], XLXN_138[14], XLXN_138[15], XLXN_138[16], XLXN_138[17], XLXN_138[18], XLXN_138[19], XLXN_138[20], XLXN_138[21], XLXN_138[22], XLXN_138[23], XLXN_138[24], XLXN_138[25], XLXN_138[26], XLXN_138[27], XLXN_138[28], XLXN_138[29], XLXN_138[30], XLXN_138[31], XLXN_138[32], XLXN_138[33], XLXN_138[34], XLXN_138[35], XLXN_138[36], XLXN_138[37], XLXN_138[38], XLXN_138[39], XLXN_138[40], XLXN_138[41], XLXN_138[42], XLXN_138[43], XLXN_138[44], XLXN_138[45], XLXN_138[46], XLXN_138[47]}));
  rotR2 XLXI_21 (
    .myinput({XLXN_135[0], XLXN_135[1], XLXN_135[2], XLXN_135[3], XLXN_135[4], XLXN_135[5], XLXN_135[6], XLXN_135[7], XLXN_135[8], XLXN_135[9], XLXN_135[10], XLXN_135[11], XLXN_135[12], XLXN_135[13], XLXN_135[14], XLXN_135[15], XLXN_135[16], XLXN_135[17], XLXN_135[18], XLXN_135[19], XLXN_135[20], XLXN_135[21], XLXN_135[22], XLXN_135[23], XLXN_135[24], XLXN_135[25], XLXN_135[26], XLXN_135[27]}),
    .myoutput({XLXN_177[0], XLXN_177[1], XLXN_177[2], XLXN_177[3], XLXN_177[4], XLXN_177[5], XLXN_177[6], XLXN_177[7], XLXN_177[8], XLXN_177[9], XLXN_177[10], XLXN_177[11], XLXN_177[12], XLXN_177[13], XLXN_177[14], XLXN_177[15], XLXN_177[16], XLXN_177[17], XLXN_177[18], XLXN_177[19], XLXN_177[20], XLXN_177[21], XLXN_177[22], XLXN_177[23], XLXN_177[24], XLXN_177[25], XLXN_177[26], XLXN_177[27]}));
  rotR2 XLXI_22 (
    .myinput({XLXN_134[0], XLXN_134[1], XLXN_134[2], XLXN_134[3], XLXN_134[4], XLXN_134[5], XLXN_134[6], XLXN_134[7], XLXN_134[8], XLXN_134[9], XLXN_134[10], XLXN_134[11], XLXN_134[12], XLXN_134[13], XLXN_134[14], XLXN_134[15], XLXN_134[16], XLXN_134[17], XLXN_134[18], XLXN_134[19], XLXN_134[20], XLXN_134[21], XLXN_134[22], XLXN_134[23], XLXN_134[24], XLXN_134[25], XLXN_134[26], XLXN_134[27]}),
    .myoutput({XLXN_176[0], XLXN_176[1], XLXN_176[2], XLXN_176[3], XLXN_176[4], XLXN_176[5], XLXN_176[6], XLXN_176[7], XLXN_176[8], XLXN_176[9], XLXN_176[10], XLXN_176[11], XLXN_176[12], XLXN_176[13], XLXN_176[14], XLXN_176[15], XLXN_176[16], XLXN_176[17], XLXN_176[18], XLXN_176[19], XLXN_176[20], XLXN_176[21], XLXN_176[22], XLXN_176[23], XLXN_176[24], XLXN_176[25], XLXN_176[26], XLXN_176[27]}));
  Feistel XLXI_23 (
    .rightIn({XLXN_132[0], XLXN_132[1], XLXN_132[2], XLXN_132[3], XLXN_132[4], XLXN_132[5], XLXN_132[6], XLXN_132[7], XLXN_132[8], XLXN_132[9], XLXN_132[10], XLXN_132[11], XLXN_132[12], XLXN_132[13], XLXN_132[14], XLXN_132[15], XLXN_132[16], XLXN_132[17], XLXN_132[18], XLXN_132[19], XLXN_132[20], XLXN_132[21], XLXN_132[22], XLXN_132[23], XLXN_132[24], XLXN_132[25], XLXN_132[26], XLXN_132[27], XLXN_132[28], XLXN_132[29], XLXN_132[30], XLXN_132[31]}),
    .keyIn({XLXN_138[0], XLXN_138[1], XLXN_138[2], XLXN_138[3], XLXN_138[4], XLXN_138[5], XLXN_138[6], XLXN_138[7], XLXN_138[8], XLXN_138[9], XLXN_138[10], XLXN_138[11], XLXN_138[12], XLXN_138[13], XLXN_138[14], XLXN_138[15], XLXN_138[16], XLXN_138[17], XLXN_138[18], XLXN_138[19], XLXN_138[20], XLXN_138[21], XLXN_138[22], XLXN_138[23], XLXN_138[24], XLXN_138[25], XLXN_138[26], XLXN_138[27], XLXN_138[28], XLXN_138[29], XLXN_138[30], XLXN_138[31], XLXN_138[32], XLXN_138[33], XLXN_138[34], XLXN_138[35], XLXN_138[36], XLXN_138[37], XLXN_138[38], XLXN_138[39], XLXN_138[40], XLXN_138[41], XLXN_138[42], XLXN_138[43], XLXN_138[44], XLXN_138[45], XLXN_138[46], XLXN_138[47]}),
    .leftIn({XLXN_133[0], XLXN_133[1], XLXN_133[2], XLXN_133[3], XLXN_133[4], XLXN_133[5], XLXN_133[6], XLXN_133[7], XLXN_133[8], XLXN_133[9], XLXN_133[10], XLXN_133[11], XLXN_133[12], XLXN_133[13], XLXN_133[14], XLXN_133[15], XLXN_133[16], XLXN_133[17], XLXN_133[18], XLXN_133[19], XLXN_133[20], XLXN_133[21], XLXN_133[22], XLXN_133[23], XLXN_133[24], XLXN_133[25], XLXN_133[26], XLXN_133[27], XLXN_133[28], XLXN_133[29], XLXN_133[30], XLXN_133[31]}),
    .rightOut({XLXN_175[0], XLXN_175[1], XLXN_175[2], XLXN_175[3], XLXN_175[4], XLXN_175[5], XLXN_175[6], XLXN_175[7], XLXN_175[8], XLXN_175[9], XLXN_175[10], XLXN_175[11], XLXN_175[12], XLXN_175[13], XLXN_175[14], XLXN_175[15], XLXN_175[16], XLXN_175[17], XLXN_175[18], XLXN_175[19], XLXN_175[20], XLXN_175[21], XLXN_175[22], XLXN_175[23], XLXN_175[24], XLXN_175[25], XLXN_175[26], XLXN_175[27], XLXN_175[28], XLXN_175[29], XLXN_175[30], XLXN_175[31]}));
  rotR2 XLXI_43 (
    .myinput({XLXN_172[0], XLXN_172[1], XLXN_172[2], XLXN_172[3], XLXN_172[4], XLXN_172[5], XLXN_172[6], XLXN_172[7], XLXN_172[8], XLXN_172[9], XLXN_172[10], XLXN_172[11], XLXN_172[12], XLXN_172[13], XLXN_172[14], XLXN_172[15], XLXN_172[16], XLXN_172[17], XLXN_172[18], XLXN_172[19], XLXN_172[20], XLXN_172[21], XLXN_172[22], XLXN_172[23], XLXN_172[24], XLXN_172[25], XLXN_172[26], XLXN_172[27]}),
    .myoutput({XLXN_186[0], XLXN_186[1], XLXN_186[2], XLXN_186[3], XLXN_186[4], XLXN_186[5], XLXN_186[6], XLXN_186[7], XLXN_186[8], XLXN_186[9], XLXN_186[10], XLXN_186[11], XLXN_186[12], XLXN_186[13], XLXN_186[14], XLXN_186[15], XLXN_186[16], XLXN_186[17], XLXN_186[18], XLXN_186[19], XLXN_186[20], XLXN_186[21], XLXN_186[22], XLXN_186[23], XLXN_186[24], XLXN_186[25], XLXN_186[26], XLXN_186[27]}));
  rotR2 XLXI_44 (
    .myinput({XLXN_171[0], XLXN_171[1], XLXN_171[2], XLXN_171[3], XLXN_171[4], XLXN_171[5], XLXN_171[6], XLXN_171[7], XLXN_171[8], XLXN_171[9], XLXN_171[10], XLXN_171[11], XLXN_171[12], XLXN_171[13], XLXN_171[14], XLXN_171[15], XLXN_171[16], XLXN_171[17], XLXN_171[18], XLXN_171[19], XLXN_171[20], XLXN_171[21], XLXN_171[22], XLXN_171[23], XLXN_171[24], XLXN_171[25], XLXN_171[26], XLXN_171[27]}),
    .myoutput({XLXN_185[0], XLXN_185[1], XLXN_185[2], XLXN_185[3], XLXN_185[4], XLXN_185[5], XLXN_185[6], XLXN_185[7], XLXN_185[8], XLXN_185[9], XLXN_185[10], XLXN_185[11], XLXN_185[12], XLXN_185[13], XLXN_185[14], XLXN_185[15], XLXN_185[16], XLXN_185[17], XLXN_185[18], XLXN_185[19], XLXN_185[20], XLXN_185[21], XLXN_185[22], XLXN_185[23], XLXN_185[24], XLXN_185[25], XLXN_185[26], XLXN_185[27]}));
  Feistel XLXI_45 (
    .rightIn({XLXN_169[0], XLXN_169[1], XLXN_169[2], XLXN_169[3], XLXN_169[4], XLXN_169[5], XLXN_169[6], XLXN_169[7], XLXN_169[8], XLXN_169[9], XLXN_169[10], XLXN_169[11], XLXN_169[12], XLXN_169[13], XLXN_169[14], XLXN_169[15], XLXN_169[16], XLXN_169[17], XLXN_169[18], XLXN_169[19], XLXN_169[20], XLXN_169[21], XLXN_169[22], XLXN_169[23], XLXN_169[24], XLXN_169[25], XLXN_169[26], XLXN_169[27], XLXN_169[28], XLXN_169[29], XLXN_169[30], XLXN_169[31]}),
    .keyIn({XLXN_173[0], XLXN_173[1], XLXN_173[2], XLXN_173[3], XLXN_173[4], XLXN_173[5], XLXN_173[6], XLXN_173[7], XLXN_173[8], XLXN_173[9], XLXN_173[10], XLXN_173[11], XLXN_173[12], XLXN_173[13], XLXN_173[14], XLXN_173[15], XLXN_173[16], XLXN_173[17], XLXN_173[18], XLXN_173[19], XLXN_173[20], XLXN_173[21], XLXN_173[22], XLXN_173[23], XLXN_173[24], XLXN_173[25], XLXN_173[26], XLXN_173[27], XLXN_173[28], XLXN_173[29], XLXN_173[30], XLXN_173[31], XLXN_173[32], XLXN_173[33], XLXN_173[34], XLXN_173[35], XLXN_173[36], XLXN_173[37], XLXN_173[38], XLXN_173[39], XLXN_173[40], XLXN_173[41], XLXN_173[42], XLXN_173[43], XLXN_173[44], XLXN_173[45], XLXN_173[46], XLXN_173[47]}),
    .leftIn({XLXN_170[0], XLXN_170[1], XLXN_170[2], XLXN_170[3], XLXN_170[4], XLXN_170[5], XLXN_170[6], XLXN_170[7], XLXN_170[8], XLXN_170[9], XLXN_170[10], XLXN_170[11], XLXN_170[12], XLXN_170[13], XLXN_170[14], XLXN_170[15], XLXN_170[16], XLXN_170[17], XLXN_170[18], XLXN_170[19], XLXN_170[20], XLXN_170[21], XLXN_170[22], XLXN_170[23], XLXN_170[24], XLXN_170[25], XLXN_170[26], XLXN_170[27], XLXN_170[28], XLXN_170[29], XLXN_170[30], XLXN_170[31]}),
    .rightOut({XLXN_184[0], XLXN_184[1], XLXN_184[2], XLXN_184[3], XLXN_184[4], XLXN_184[5], XLXN_184[6], XLXN_184[7], XLXN_184[8], XLXN_184[9], XLXN_184[10], XLXN_184[11], XLXN_184[12], XLXN_184[13], XLXN_184[14], XLXN_184[15], XLXN_184[16], XLXN_184[17], XLXN_184[18], XLXN_184[19], XLXN_184[20], XLXN_184[21], XLXN_184[22], XLXN_184[23], XLXN_184[24], XLXN_184[25], XLXN_184[26], XLXN_184[27], XLXN_184[28], XLXN_184[29], XLXN_184[30], XLXN_184[31]}));
  PC2 XLXI_46 (
    .rightinput({XLXN_172[0], XLXN_172[1], XLXN_172[2], XLXN_172[3], XLXN_172[4], XLXN_172[5], XLXN_172[6], XLXN_172[7], XLXN_172[8], XLXN_172[9], XLXN_172[10], XLXN_172[11], XLXN_172[12], XLXN_172[13], XLXN_172[14], XLXN_172[15], XLXN_172[16], XLXN_172[17], XLXN_172[18], XLXN_172[19], XLXN_172[20], XLXN_172[21], XLXN_172[22], XLXN_172[23], XLXN_172[24], XLXN_172[25], XLXN_172[26], XLXN_172[27]}),
    .leftinput({XLXN_171[0], XLXN_171[1], XLXN_171[2], XLXN_171[3], XLXN_171[4], XLXN_171[5], XLXN_171[6], XLXN_171[7], XLXN_171[8], XLXN_171[9], XLXN_171[10], XLXN_171[11], XLXN_171[12], XLXN_171[13], XLXN_171[14], XLXN_171[15], XLXN_171[16], XLXN_171[17], XLXN_171[18], XLXN_171[19], XLXN_171[20], XLXN_171[21], XLXN_171[22], XLXN_171[23], XLXN_171[24], XLXN_171[25], XLXN_171[26], XLXN_171[27]}),
    .myoutput({XLXN_173[0], XLXN_173[1], XLXN_173[2], XLXN_173[3], XLXN_173[4], XLXN_173[5], XLXN_173[6], XLXN_173[7], XLXN_173[8], XLXN_173[9], XLXN_173[10], XLXN_173[11], XLXN_173[12], XLXN_173[13], XLXN_173[14], XLXN_173[15], XLXN_173[16], XLXN_173[17], XLXN_173[18], XLXN_173[19], XLXN_173[20], XLXN_173[21], XLXN_173[22], XLXN_173[23], XLXN_173[24], XLXN_173[25], XLXN_173[26], XLXN_173[27], XLXN_173[28], XLXN_173[29], XLXN_173[30], XLXN_173[31], XLXN_173[32], XLXN_173[33], XLXN_173[34], XLXN_173[35], XLXN_173[36], XLXN_173[37], XLXN_173[38], XLXN_173[39], XLXN_173[40], XLXN_173[41], XLXN_173[42], XLXN_173[43], XLXN_173[44], XLXN_173[45], XLXN_173[46], XLXN_173[47]}));
  syncReg XLXI_47 (
    .clk(Clk_50MHz),
    .leftIn({XLXN_132[0], XLXN_132[1], XLXN_132[2], XLXN_132[3], XLXN_132[4], XLXN_132[5], XLXN_132[6], XLXN_132[7], XLXN_132[8], XLXN_132[9], XLXN_132[10], XLXN_132[11], XLXN_132[12], XLXN_132[13], XLXN_132[14], XLXN_132[15], XLXN_132[16], XLXN_132[17], XLXN_132[18], XLXN_132[19], XLXN_132[20], XLXN_132[21], XLXN_132[22], XLXN_132[23], XLXN_132[24], XLXN_132[25], XLXN_132[26], XLXN_132[27], XLXN_132[28], XLXN_132[29], XLXN_132[30], XLXN_132[31]}),
    .rightIn({XLXN_175[0], XLXN_175[1], XLXN_175[2], XLXN_175[3], XLXN_175[4], XLXN_175[5], XLXN_175[6], XLXN_175[7], XLXN_175[8], XLXN_175[9], XLXN_175[10], XLXN_175[11], XLXN_175[12], XLXN_175[13], XLXN_175[14], XLXN_175[15], XLXN_175[16], XLXN_175[17], XLXN_175[18], XLXN_175[19], XLXN_175[20], XLXN_175[21], XLXN_175[22], XLXN_175[23], XLXN_175[24], XLXN_175[25], XLXN_175[26], XLXN_175[27], XLXN_175[28], XLXN_175[29], XLXN_175[30], XLXN_175[31]}),
    .leftkeyIn({XLXN_176[0], XLXN_176[1], XLXN_176[2], XLXN_176[3], XLXN_176[4], XLXN_176[5], XLXN_176[6], XLXN_176[7], XLXN_176[8], XLXN_176[9], XLXN_176[10], XLXN_176[11], XLXN_176[12], XLXN_176[13], XLXN_176[14], XLXN_176[15], XLXN_176[16], XLXN_176[17], XLXN_176[18], XLXN_176[19], XLXN_176[20], XLXN_176[21], XLXN_176[22], XLXN_176[23], XLXN_176[24], XLXN_176[25], XLXN_176[26], XLXN_176[27]}),
    .rightkeyIn({XLXN_177[0], XLXN_177[1], XLXN_177[2], XLXN_177[3], XLXN_177[4], XLXN_177[5], XLXN_177[6], XLXN_177[7], XLXN_177[8], XLXN_177[9], XLXN_177[10], XLXN_177[11], XLXN_177[12], XLXN_177[13], XLXN_177[14], XLXN_177[15], XLXN_177[16], XLXN_177[17], XLXN_177[18], XLXN_177[19], XLXN_177[20], XLXN_177[21], XLXN_177[22], XLXN_177[23], XLXN_177[24], XLXN_177[25], XLXN_177[26], XLXN_177[27]}),
    .leftOut({XLXN_170[0], XLXN_170[1], XLXN_170[2], XLXN_170[3], XLXN_170[4], XLXN_170[5], XLXN_170[6], XLXN_170[7], XLXN_170[8], XLXN_170[9], XLXN_170[10], XLXN_170[11], XLXN_170[12], XLXN_170[13], XLXN_170[14], XLXN_170[15], XLXN_170[16], XLXN_170[17], XLXN_170[18], XLXN_170[19], XLXN_170[20], XLXN_170[21], XLXN_170[22], XLXN_170[23], XLXN_170[24], XLXN_170[25], XLXN_170[26], XLXN_170[27], XLXN_170[28], XLXN_170[29], XLXN_170[30], XLXN_170[31]}),
    .rightOut({XLXN_169[0], XLXN_169[1], XLXN_169[2], XLXN_169[3], XLXN_169[4], XLXN_169[5], XLXN_169[6], XLXN_169[7], XLXN_169[8], XLXN_169[9], XLXN_169[10], XLXN_169[11], XLXN_169[12], XLXN_169[13], XLXN_169[14], XLXN_169[15], XLXN_169[16], XLXN_169[17], XLXN_169[18], XLXN_169[19], XLXN_169[20], XLXN_169[21], XLXN_169[22], XLXN_169[23], XLXN_169[24], XLXN_169[25], XLXN_169[26], XLXN_169[27], XLXN_169[28], XLXN_169[29], XLXN_169[30], XLXN_169[31]}),
    .leftkeyOut({XLXN_171[0], XLXN_171[1], XLXN_171[2], XLXN_171[3], XLXN_171[4], XLXN_171[5], XLXN_171[6], XLXN_171[7], XLXN_171[8], XLXN_171[9], XLXN_171[10], XLXN_171[11], XLXN_171[12], XLXN_171[13], XLXN_171[14], XLXN_171[15], XLXN_171[16], XLXN_171[17], XLXN_171[18], XLXN_171[19], XLXN_171[20], XLXN_171[21], XLXN_171[22], XLXN_171[23], XLXN_171[24], XLXN_171[25], XLXN_171[26], XLXN_171[27]}),
    .rightkeyOut({XLXN_172[0], XLXN_172[1], XLXN_172[2], XLXN_172[3], XLXN_172[4], XLXN_172[5], XLXN_172[6], XLXN_172[7], XLXN_172[8], XLXN_172[9], XLXN_172[10], XLXN_172[11], XLXN_172[12], XLXN_172[13], XLXN_172[14], XLXN_172[15], XLXN_172[16], XLXN_172[17], XLXN_172[18], XLXN_172[19], XLXN_172[20], XLXN_172[21], XLXN_172[22], XLXN_172[23], XLXN_172[24], XLXN_172[25], XLXN_172[26], XLXN_172[27]}),
    .CE(CE));
  rotR2 XLXI_48 (
    .myinput({XLXN_181[0], XLXN_181[1], XLXN_181[2], XLXN_181[3], XLXN_181[4], XLXN_181[5], XLXN_181[6], XLXN_181[7], XLXN_181[8], XLXN_181[9], XLXN_181[10], XLXN_181[11], XLXN_181[12], XLXN_181[13], XLXN_181[14], XLXN_181[15], XLXN_181[16], XLXN_181[17], XLXN_181[18], XLXN_181[19], XLXN_181[20], XLXN_181[21], XLXN_181[22], XLXN_181[23], XLXN_181[24], XLXN_181[25], XLXN_181[26], XLXN_181[27]}),
    .myoutput({XLXN_326[0], XLXN_326[1], XLXN_326[2], XLXN_326[3], XLXN_326[4], XLXN_326[5], XLXN_326[6], XLXN_326[7], XLXN_326[8], XLXN_326[9], XLXN_326[10], XLXN_326[11], XLXN_326[12], XLXN_326[13], XLXN_326[14], XLXN_326[15], XLXN_326[16], XLXN_326[17], XLXN_326[18], XLXN_326[19], XLXN_326[20], XLXN_326[21], XLXN_326[22], XLXN_326[23], XLXN_326[24], XLXN_326[25], XLXN_326[26], XLXN_326[27]}));
  rotR2 XLXI_49 (
    .myinput({XLXN_180[0], XLXN_180[1], XLXN_180[2], XLXN_180[3], XLXN_180[4], XLXN_180[5], XLXN_180[6], XLXN_180[7], XLXN_180[8], XLXN_180[9], XLXN_180[10], XLXN_180[11], XLXN_180[12], XLXN_180[13], XLXN_180[14], XLXN_180[15], XLXN_180[16], XLXN_180[17], XLXN_180[18], XLXN_180[19], XLXN_180[20], XLXN_180[21], XLXN_180[22], XLXN_180[23], XLXN_180[24], XLXN_180[25], XLXN_180[26], XLXN_180[27]}),
    .myoutput({XLXN_330[0], XLXN_330[1], XLXN_330[2], XLXN_330[3], XLXN_330[4], XLXN_330[5], XLXN_330[6], XLXN_330[7], XLXN_330[8], XLXN_330[9], XLXN_330[10], XLXN_330[11], XLXN_330[12], XLXN_330[13], XLXN_330[14], XLXN_330[15], XLXN_330[16], XLXN_330[17], XLXN_330[18], XLXN_330[19], XLXN_330[20], XLXN_330[21], XLXN_330[22], XLXN_330[23], XLXN_330[24], XLXN_330[25], XLXN_330[26], XLXN_330[27]}));
  Feistel XLXI_50 (
    .rightIn({XLXN_178[0], XLXN_178[1], XLXN_178[2], XLXN_178[3], XLXN_178[4], XLXN_178[5], XLXN_178[6], XLXN_178[7], XLXN_178[8], XLXN_178[9], XLXN_178[10], XLXN_178[11], XLXN_178[12], XLXN_178[13], XLXN_178[14], XLXN_178[15], XLXN_178[16], XLXN_178[17], XLXN_178[18], XLXN_178[19], XLXN_178[20], XLXN_178[21], XLXN_178[22], XLXN_178[23], XLXN_178[24], XLXN_178[25], XLXN_178[26], XLXN_178[27], XLXN_178[28], XLXN_178[29], XLXN_178[30], XLXN_178[31]}),
    .keyIn({XLXN_182[0], XLXN_182[1], XLXN_182[2], XLXN_182[3], XLXN_182[4], XLXN_182[5], XLXN_182[6], XLXN_182[7], XLXN_182[8], XLXN_182[9], XLXN_182[10], XLXN_182[11], XLXN_182[12], XLXN_182[13], XLXN_182[14], XLXN_182[15], XLXN_182[16], XLXN_182[17], XLXN_182[18], XLXN_182[19], XLXN_182[20], XLXN_182[21], XLXN_182[22], XLXN_182[23], XLXN_182[24], XLXN_182[25], XLXN_182[26], XLXN_182[27], XLXN_182[28], XLXN_182[29], XLXN_182[30], XLXN_182[31], XLXN_182[32], XLXN_182[33], XLXN_182[34], XLXN_182[35], XLXN_182[36], XLXN_182[37], XLXN_182[38], XLXN_182[39], XLXN_182[40], XLXN_182[41], XLXN_182[42], XLXN_182[43], XLXN_182[44], XLXN_182[45], XLXN_182[46], XLXN_182[47]}),
    .leftIn({XLXN_179[0], XLXN_179[1], XLXN_179[2], XLXN_179[3], XLXN_179[4], XLXN_179[5], XLXN_179[6], XLXN_179[7], XLXN_179[8], XLXN_179[9], XLXN_179[10], XLXN_179[11], XLXN_179[12], XLXN_179[13], XLXN_179[14], XLXN_179[15], XLXN_179[16], XLXN_179[17], XLXN_179[18], XLXN_179[19], XLXN_179[20], XLXN_179[21], XLXN_179[22], XLXN_179[23], XLXN_179[24], XLXN_179[25], XLXN_179[26], XLXN_179[27], XLXN_179[28], XLXN_179[29], XLXN_179[30], XLXN_179[31]}),
    .rightOut({XLXN_332[0], XLXN_332[1], XLXN_332[2], XLXN_332[3], XLXN_332[4], XLXN_332[5], XLXN_332[6], XLXN_332[7], XLXN_332[8], XLXN_332[9], XLXN_332[10], XLXN_332[11], XLXN_332[12], XLXN_332[13], XLXN_332[14], XLXN_332[15], XLXN_332[16], XLXN_332[17], XLXN_332[18], XLXN_332[19], XLXN_332[20], XLXN_332[21], XLXN_332[22], XLXN_332[23], XLXN_332[24], XLXN_332[25], XLXN_332[26], XLXN_332[27], XLXN_332[28], XLXN_332[29], XLXN_332[30], XLXN_332[31]}));
  PC2 XLXI_51 (
    .rightinput({XLXN_181[0], XLXN_181[1], XLXN_181[2], XLXN_181[3], XLXN_181[4], XLXN_181[5], XLXN_181[6], XLXN_181[7], XLXN_181[8], XLXN_181[9], XLXN_181[10], XLXN_181[11], XLXN_181[12], XLXN_181[13], XLXN_181[14], XLXN_181[15], XLXN_181[16], XLXN_181[17], XLXN_181[18], XLXN_181[19], XLXN_181[20], XLXN_181[21], XLXN_181[22], XLXN_181[23], XLXN_181[24], XLXN_181[25], XLXN_181[26], XLXN_181[27]}),
    .leftinput({XLXN_180[0], XLXN_180[1], XLXN_180[2], XLXN_180[3], XLXN_180[4], XLXN_180[5], XLXN_180[6], XLXN_180[7], XLXN_180[8], XLXN_180[9], XLXN_180[10], XLXN_180[11], XLXN_180[12], XLXN_180[13], XLXN_180[14], XLXN_180[15], XLXN_180[16], XLXN_180[17], XLXN_180[18], XLXN_180[19], XLXN_180[20], XLXN_180[21], XLXN_180[22], XLXN_180[23], XLXN_180[24], XLXN_180[25], XLXN_180[26], XLXN_180[27]}),
    .myoutput({XLXN_182[0], XLXN_182[1], XLXN_182[2], XLXN_182[3], XLXN_182[4], XLXN_182[5], XLXN_182[6], XLXN_182[7], XLXN_182[8], XLXN_182[9], XLXN_182[10], XLXN_182[11], XLXN_182[12], XLXN_182[13], XLXN_182[14], XLXN_182[15], XLXN_182[16], XLXN_182[17], XLXN_182[18], XLXN_182[19], XLXN_182[20], XLXN_182[21], XLXN_182[22], XLXN_182[23], XLXN_182[24], XLXN_182[25], XLXN_182[26], XLXN_182[27], XLXN_182[28], XLXN_182[29], XLXN_182[30], XLXN_182[31], XLXN_182[32], XLXN_182[33], XLXN_182[34], XLXN_182[35], XLXN_182[36], XLXN_182[37], XLXN_182[38], XLXN_182[39], XLXN_182[40], XLXN_182[41], XLXN_182[42], XLXN_182[43], XLXN_182[44], XLXN_182[45], XLXN_182[46], XLXN_182[47]}));
  syncReg XLXI_52 (
    .clk(Clk_50MHz),
    .leftIn({XLXN_169[0], XLXN_169[1], XLXN_169[2], XLXN_169[3], XLXN_169[4], XLXN_169[5], XLXN_169[6], XLXN_169[7], XLXN_169[8], XLXN_169[9], XLXN_169[10], XLXN_169[11], XLXN_169[12], XLXN_169[13], XLXN_169[14], XLXN_169[15], XLXN_169[16], XLXN_169[17], XLXN_169[18], XLXN_169[19], XLXN_169[20], XLXN_169[21], XLXN_169[22], XLXN_169[23], XLXN_169[24], XLXN_169[25], XLXN_169[26], XLXN_169[27], XLXN_169[28], XLXN_169[29], XLXN_169[30], XLXN_169[31]}),
    .rightIn({XLXN_184[0], XLXN_184[1], XLXN_184[2], XLXN_184[3], XLXN_184[4], XLXN_184[5], XLXN_184[6], XLXN_184[7], XLXN_184[8], XLXN_184[9], XLXN_184[10], XLXN_184[11], XLXN_184[12], XLXN_184[13], XLXN_184[14], XLXN_184[15], XLXN_184[16], XLXN_184[17], XLXN_184[18], XLXN_184[19], XLXN_184[20], XLXN_184[21], XLXN_184[22], XLXN_184[23], XLXN_184[24], XLXN_184[25], XLXN_184[26], XLXN_184[27], XLXN_184[28], XLXN_184[29], XLXN_184[30], XLXN_184[31]}),
    .leftkeyIn({XLXN_185[0], XLXN_185[1], XLXN_185[2], XLXN_185[3], XLXN_185[4], XLXN_185[5], XLXN_185[6], XLXN_185[7], XLXN_185[8], XLXN_185[9], XLXN_185[10], XLXN_185[11], XLXN_185[12], XLXN_185[13], XLXN_185[14], XLXN_185[15], XLXN_185[16], XLXN_185[17], XLXN_185[18], XLXN_185[19], XLXN_185[20], XLXN_185[21], XLXN_185[22], XLXN_185[23], XLXN_185[24], XLXN_185[25], XLXN_185[26], XLXN_185[27]}),
    .rightkeyIn({XLXN_186[0], XLXN_186[1], XLXN_186[2], XLXN_186[3], XLXN_186[4], XLXN_186[5], XLXN_186[6], XLXN_186[7], XLXN_186[8], XLXN_186[9], XLXN_186[10], XLXN_186[11], XLXN_186[12], XLXN_186[13], XLXN_186[14], XLXN_186[15], XLXN_186[16], XLXN_186[17], XLXN_186[18], XLXN_186[19], XLXN_186[20], XLXN_186[21], XLXN_186[22], XLXN_186[23], XLXN_186[24], XLXN_186[25], XLXN_186[26], XLXN_186[27]}),
    .leftOut({XLXN_179[0], XLXN_179[1], XLXN_179[2], XLXN_179[3], XLXN_179[4], XLXN_179[5], XLXN_179[6], XLXN_179[7], XLXN_179[8], XLXN_179[9], XLXN_179[10], XLXN_179[11], XLXN_179[12], XLXN_179[13], XLXN_179[14], XLXN_179[15], XLXN_179[16], XLXN_179[17], XLXN_179[18], XLXN_179[19], XLXN_179[20], XLXN_179[21], XLXN_179[22], XLXN_179[23], XLXN_179[24], XLXN_179[25], XLXN_179[26], XLXN_179[27], XLXN_179[28], XLXN_179[29], XLXN_179[30], XLXN_179[31]}),
    .rightOut({XLXN_178[0], XLXN_178[1], XLXN_178[2], XLXN_178[3], XLXN_178[4], XLXN_178[5], XLXN_178[6], XLXN_178[7], XLXN_178[8], XLXN_178[9], XLXN_178[10], XLXN_178[11], XLXN_178[12], XLXN_178[13], XLXN_178[14], XLXN_178[15], XLXN_178[16], XLXN_178[17], XLXN_178[18], XLXN_178[19], XLXN_178[20], XLXN_178[21], XLXN_178[22], XLXN_178[23], XLXN_178[24], XLXN_178[25], XLXN_178[26], XLXN_178[27], XLXN_178[28], XLXN_178[29], XLXN_178[30], XLXN_178[31]}),
    .leftkeyOut({XLXN_180[0], XLXN_180[1], XLXN_180[2], XLXN_180[3], XLXN_180[4], XLXN_180[5], XLXN_180[6], XLXN_180[7], XLXN_180[8], XLXN_180[9], XLXN_180[10], XLXN_180[11], XLXN_180[12], XLXN_180[13], XLXN_180[14], XLXN_180[15], XLXN_180[16], XLXN_180[17], XLXN_180[18], XLXN_180[19], XLXN_180[20], XLXN_180[21], XLXN_180[22], XLXN_180[23], XLXN_180[24], XLXN_180[25], XLXN_180[26], XLXN_180[27]}),
    .rightkeyOut({XLXN_181[0], XLXN_181[1], XLXN_181[2], XLXN_181[3], XLXN_181[4], XLXN_181[5], XLXN_181[6], XLXN_181[7], XLXN_181[8], XLXN_181[9], XLXN_181[10], XLXN_181[11], XLXN_181[12], XLXN_181[13], XLXN_181[14], XLXN_181[15], XLXN_181[16], XLXN_181[17], XLXN_181[18], XLXN_181[19], XLXN_181[20], XLXN_181[21], XLXN_181[22], XLXN_181[23], XLXN_181[24], XLXN_181[25], XLXN_181[26], XLXN_181[27]}),
    .CE(CE));
  rotR2 XLXI_53 (
    .myinput({XLXN_190[0], XLXN_190[1], XLXN_190[2], XLXN_190[3], XLXN_190[4], XLXN_190[5], XLXN_190[6], XLXN_190[7], XLXN_190[8], XLXN_190[9], XLXN_190[10], XLXN_190[11], XLXN_190[12], XLXN_190[13], XLXN_190[14], XLXN_190[15], XLXN_190[16], XLXN_190[17], XLXN_190[18], XLXN_190[19], XLXN_190[20], XLXN_190[21], XLXN_190[22], XLXN_190[23], XLXN_190[24], XLXN_190[25], XLXN_190[26], XLXN_190[27]}),
    .myoutput({XLXN_204[0], XLXN_204[1], XLXN_204[2], XLXN_204[3], XLXN_204[4], XLXN_204[5], XLXN_204[6], XLXN_204[7], XLXN_204[8], XLXN_204[9], XLXN_204[10], XLXN_204[11], XLXN_204[12], XLXN_204[13], XLXN_204[14], XLXN_204[15], XLXN_204[16], XLXN_204[17], XLXN_204[18], XLXN_204[19], XLXN_204[20], XLXN_204[21], XLXN_204[22], XLXN_204[23], XLXN_204[24], XLXN_204[25], XLXN_204[26], XLXN_204[27]}));
  rotR2 XLXI_54 (
    .myinput({XLXN_189[0], XLXN_189[1], XLXN_189[2], XLXN_189[3], XLXN_189[4], XLXN_189[5], XLXN_189[6], XLXN_189[7], XLXN_189[8], XLXN_189[9], XLXN_189[10], XLXN_189[11], XLXN_189[12], XLXN_189[13], XLXN_189[14], XLXN_189[15], XLXN_189[16], XLXN_189[17], XLXN_189[18], XLXN_189[19], XLXN_189[20], XLXN_189[21], XLXN_189[22], XLXN_189[23], XLXN_189[24], XLXN_189[25], XLXN_189[26], XLXN_189[27]}),
    .myoutput({XLXN_203[0], XLXN_203[1], XLXN_203[2], XLXN_203[3], XLXN_203[4], XLXN_203[5], XLXN_203[6], XLXN_203[7], XLXN_203[8], XLXN_203[9], XLXN_203[10], XLXN_203[11], XLXN_203[12], XLXN_203[13], XLXN_203[14], XLXN_203[15], XLXN_203[16], XLXN_203[17], XLXN_203[18], XLXN_203[19], XLXN_203[20], XLXN_203[21], XLXN_203[22], XLXN_203[23], XLXN_203[24], XLXN_203[25], XLXN_203[26], XLXN_203[27]}));
  Feistel XLXI_55 (
    .rightIn({XLXN_187[0], XLXN_187[1], XLXN_187[2], XLXN_187[3], XLXN_187[4], XLXN_187[5], XLXN_187[6], XLXN_187[7], XLXN_187[8], XLXN_187[9], XLXN_187[10], XLXN_187[11], XLXN_187[12], XLXN_187[13], XLXN_187[14], XLXN_187[15], XLXN_187[16], XLXN_187[17], XLXN_187[18], XLXN_187[19], XLXN_187[20], XLXN_187[21], XLXN_187[22], XLXN_187[23], XLXN_187[24], XLXN_187[25], XLXN_187[26], XLXN_187[27], XLXN_187[28], XLXN_187[29], XLXN_187[30], XLXN_187[31]}),
    .keyIn({XLXN_191[0], XLXN_191[1], XLXN_191[2], XLXN_191[3], XLXN_191[4], XLXN_191[5], XLXN_191[6], XLXN_191[7], XLXN_191[8], XLXN_191[9], XLXN_191[10], XLXN_191[11], XLXN_191[12], XLXN_191[13], XLXN_191[14], XLXN_191[15], XLXN_191[16], XLXN_191[17], XLXN_191[18], XLXN_191[19], XLXN_191[20], XLXN_191[21], XLXN_191[22], XLXN_191[23], XLXN_191[24], XLXN_191[25], XLXN_191[26], XLXN_191[27], XLXN_191[28], XLXN_191[29], XLXN_191[30], XLXN_191[31], XLXN_191[32], XLXN_191[33], XLXN_191[34], XLXN_191[35], XLXN_191[36], XLXN_191[37], XLXN_191[38], XLXN_191[39], XLXN_191[40], XLXN_191[41], XLXN_191[42], XLXN_191[43], XLXN_191[44], XLXN_191[45], XLXN_191[46], XLXN_191[47]}),
    .leftIn({XLXN_188[0], XLXN_188[1], XLXN_188[2], XLXN_188[3], XLXN_188[4], XLXN_188[5], XLXN_188[6], XLXN_188[7], XLXN_188[8], XLXN_188[9], XLXN_188[10], XLXN_188[11], XLXN_188[12], XLXN_188[13], XLXN_188[14], XLXN_188[15], XLXN_188[16], XLXN_188[17], XLXN_188[18], XLXN_188[19], XLXN_188[20], XLXN_188[21], XLXN_188[22], XLXN_188[23], XLXN_188[24], XLXN_188[25], XLXN_188[26], XLXN_188[27], XLXN_188[28], XLXN_188[29], XLXN_188[30], XLXN_188[31]}),
    .rightOut({XLXN_202[0], XLXN_202[1], XLXN_202[2], XLXN_202[3], XLXN_202[4], XLXN_202[5], XLXN_202[6], XLXN_202[7], XLXN_202[8], XLXN_202[9], XLXN_202[10], XLXN_202[11], XLXN_202[12], XLXN_202[13], XLXN_202[14], XLXN_202[15], XLXN_202[16], XLXN_202[17], XLXN_202[18], XLXN_202[19], XLXN_202[20], XLXN_202[21], XLXN_202[22], XLXN_202[23], XLXN_202[24], XLXN_202[25], XLXN_202[26], XLXN_202[27], XLXN_202[28], XLXN_202[29], XLXN_202[30], XLXN_202[31]}));
  PC2 XLXI_56 (
    .rightinput({XLXN_190[0], XLXN_190[1], XLXN_190[2], XLXN_190[3], XLXN_190[4], XLXN_190[5], XLXN_190[6], XLXN_190[7], XLXN_190[8], XLXN_190[9], XLXN_190[10], XLXN_190[11], XLXN_190[12], XLXN_190[13], XLXN_190[14], XLXN_190[15], XLXN_190[16], XLXN_190[17], XLXN_190[18], XLXN_190[19], XLXN_190[20], XLXN_190[21], XLXN_190[22], XLXN_190[23], XLXN_190[24], XLXN_190[25], XLXN_190[26], XLXN_190[27]}),
    .leftinput({XLXN_189[0], XLXN_189[1], XLXN_189[2], XLXN_189[3], XLXN_189[4], XLXN_189[5], XLXN_189[6], XLXN_189[7], XLXN_189[8], XLXN_189[9], XLXN_189[10], XLXN_189[11], XLXN_189[12], XLXN_189[13], XLXN_189[14], XLXN_189[15], XLXN_189[16], XLXN_189[17], XLXN_189[18], XLXN_189[19], XLXN_189[20], XLXN_189[21], XLXN_189[22], XLXN_189[23], XLXN_189[24], XLXN_189[25], XLXN_189[26], XLXN_189[27]}),
    .myoutput({XLXN_191[0], XLXN_191[1], XLXN_191[2], XLXN_191[3], XLXN_191[4], XLXN_191[5], XLXN_191[6], XLXN_191[7], XLXN_191[8], XLXN_191[9], XLXN_191[10], XLXN_191[11], XLXN_191[12], XLXN_191[13], XLXN_191[14], XLXN_191[15], XLXN_191[16], XLXN_191[17], XLXN_191[18], XLXN_191[19], XLXN_191[20], XLXN_191[21], XLXN_191[22], XLXN_191[23], XLXN_191[24], XLXN_191[25], XLXN_191[26], XLXN_191[27], XLXN_191[28], XLXN_191[29], XLXN_191[30], XLXN_191[31], XLXN_191[32], XLXN_191[33], XLXN_191[34], XLXN_191[35], XLXN_191[36], XLXN_191[37], XLXN_191[38], XLXN_191[39], XLXN_191[40], XLXN_191[41], XLXN_191[42], XLXN_191[43], XLXN_191[44], XLXN_191[45], XLXN_191[46], XLXN_191[47]}));
